# Altium schematic sheet bidirectional_switch_N.SchDoc
size A
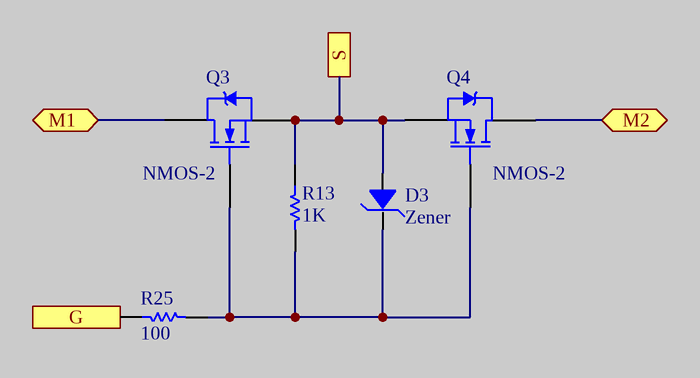
[diagram p0: bidirectional_switch_N.SchDoc]

## Parts
D3  Zener  [ZENER]
Q3  NMOS-2  [dpak]
Q4  NMOS-2  [dpak]
R13  1K  [RESC0603]
R25  100  [RESC0603]

## Ports
G (in), M1 (bidir), M2 (bidir), S

## Nets
G: R25.1 ; port G
M1: Q3.2(D) ; port M1
M2: Q4.2(D) ; port M2
S: D3.1(A) Q3.3(S) Q4.3(S) R13.1 ; port S
NetD3_2: D3.2(K) Q3.1(G) Q4.1(G) R13.2 R25.2

## Library data of the parts
Q3 Q4 = NMOS-2: N-Channel Power MOSFET; Note: Pin 2 is electrically connected to pin 4.; Published: 8-Jun-2000; LatestRevisionDate: 17-Jul-2002; LatestRevisionNote: Re-released for DXP Platform.; DatasheetVersion: PD-9.814; PackageVersion: Feb-1997; PackageReference: TO-220AB; Publisher: Altium Limited; PackageDescription: TO, Thru-Hole, Vertical, Heatsink Mounted; 3 In-Line Leads; Pitch 2.54 mm; ComponentLink1Description: Manufacturer Link; ComponentLink1URL: http://www.irf.com/
R13 R25 = Resistor: 0603,0.1W; Published: 8-Jun-2000; LatestRevisionDate: 17-Jul-2002; LatestRevisionNote: Re-released for DXP Platform.; PackageReference: AXIAL-0.5; Publisher: Altium Limited
  R13: Value: 1K
  R25: Value: 100